# Altium schematic sheet MCU.SchDoc
size A4; Date: 2020/6/21
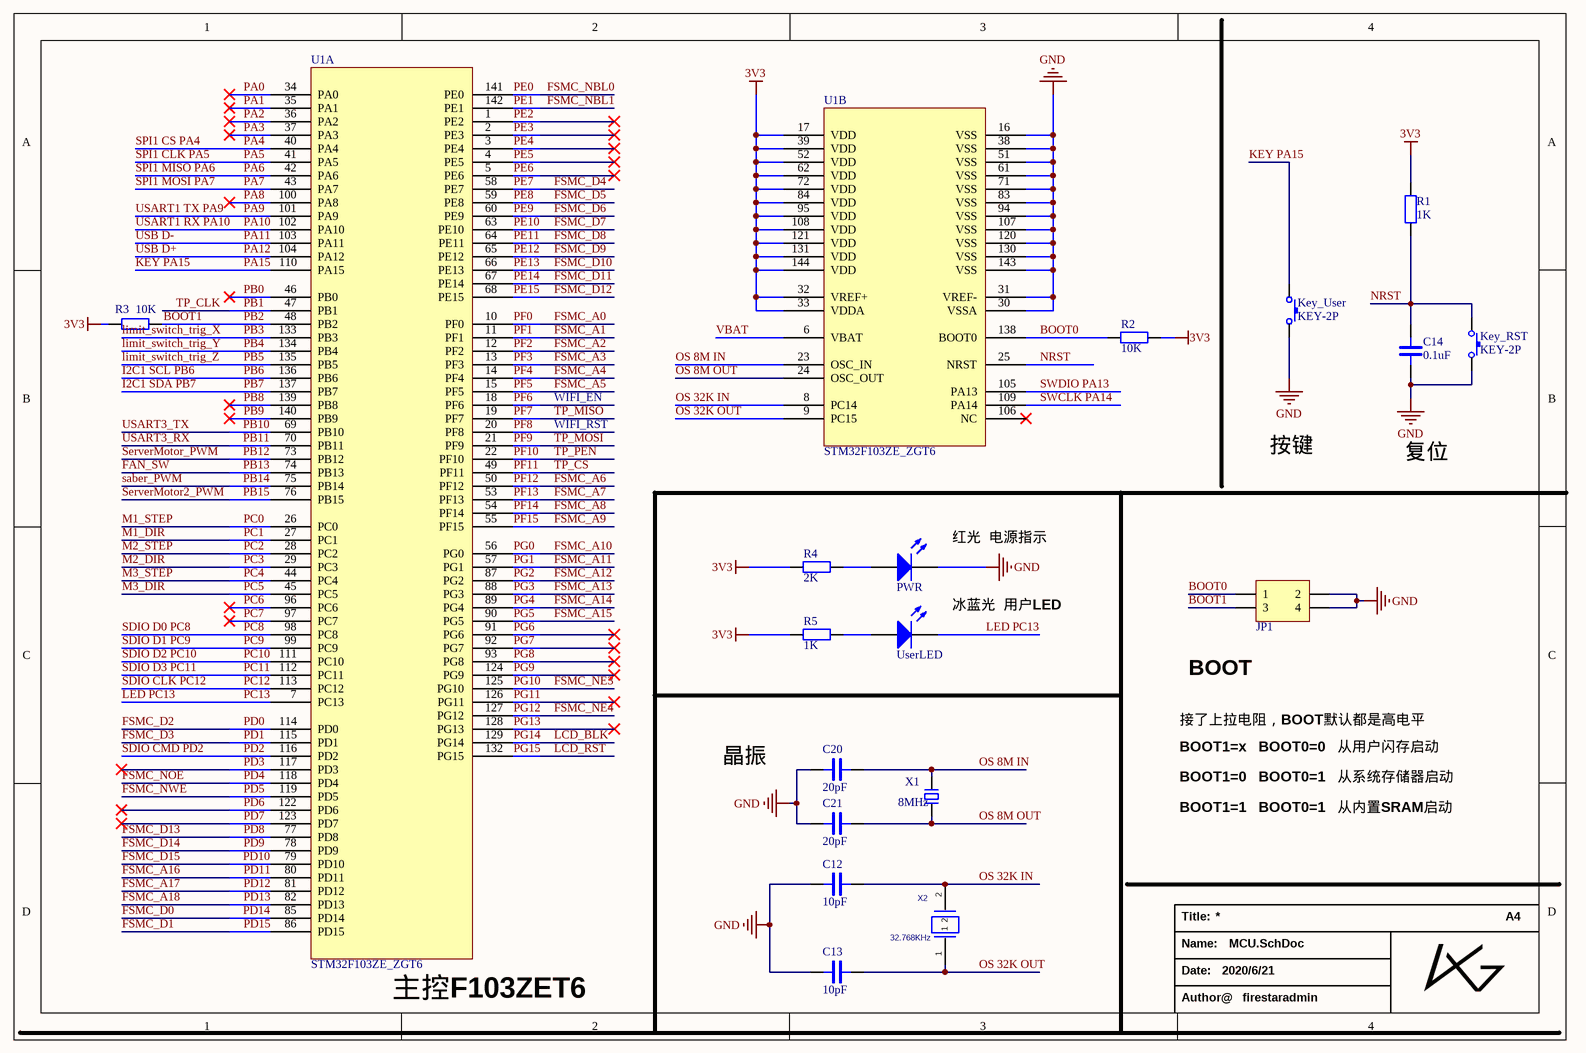
[diagram p0: MCU.SchDoc]

## Parts
C12  10pF  [C 0603_M]
C13  10pF  [C 0603_M]
C14  0.1uF  [C 0603_M]
C20  20pF  [C 0603_M]
C21  20pF  [C 0603_M]
JP1  Header2X2  [HDR2.54-LI-2x2P]  (value not drawn)
Key_RST  KEY-2P  [TSW SMD-3*6*2.5]
Key_User  KEY-2P  [TSW SMD-3*6*2.5]
PWR  LED  [LED 0603R]  (value not drawn)
R1  1K  [R 0603_M]
R2  10K  [R 0603_M]
R3  10K  [R 0603_M]
R4  2K  [R 0603_M]
R5  1K  [R 0603_M]
U1  STM32F103ZE_ZGT6  [TQFP144 20x20_M]  (parts A,B of 2)
UserLED  LED  [LED 0603B]  (value not drawn)
X1  8MHz  [OSC 5032-2P]
X2  value 32.768KHz  [OSC 3215-2P]  (hidden comment: XTAL_32.768KHZ_3215)

## Nets
3V3: R1.1 R2.2 R3.2 R4.2 R5.2 U1.17(VDD) U1.32(VREF+) U1.33(VDDA) U1.39(VDD) U1.52(VDD) U1.62(VDD) U1.72(VDD) U1.84(VDD) U1.95(VDD) U1.108(VDD) U1.121(VDD) U1.131(VDD) U1.144(VDD)
GND: C12.2 C13.2 C14.1 C20.2 C21.2 JP1.2 JP1.4 Key_RST.2 Key_User.2 PWR.2(K) U1.16(VSS) U1.30(VSSA) U1.31(VREF-) U1.38(VSS) U1.51(VSS) U1.61(VSS) U1.71(VSS) U1.83(VSS) U1.94(VSS) U1.107(VSS) U1.120(VSS) U1.130(VSS) U1.143(VSS)
BOOT0: JP1.1 R2.1 U1.138(BOOT0)
BOOT1: JP1.3 R3.1 U1.48(PB2)  [also labelled PB2]
FAN_SW: U1.74(PB13)  [also labelled PB13]
FSMC_A0: U1.10(PF0)  [also labelled PF0]
FSMC_A1: U1.11(PF1)  [also labelled PF1]
FSMC_A2: U1.12(PF2)  [also labelled PF2]
FSMC_A3: U1.13(PF3)  [also labelled PF3]
FSMC_A4: U1.14(PF4)  [also labelled PF4]
FSMC_A5: U1.15(PF5)  [also labelled PF5]
FSMC_A6: U1.50(PF12)  [also labelled PF12]
FSMC_A7: U1.53(PF13)  [also labelled PF13]
FSMC_A8: U1.54(PF14)  [also labelled PF14]
FSMC_A9: U1.55(PF15)  [also labelled PF15]
FSMC_A10: U1.56(PG0)  [also labelled PG0]
FSMC_A11: U1.57(PG1)  [also labelled PG1]
FSMC_A12: U1.87(PG2)  [also labelled PG2]
FSMC_A13: U1.88(PG3)  [also labelled PG3]
FSMC_A14: U1.89(PG4)  [also labelled PG4]
FSMC_A15: U1.90(PG5)  [also labelled PG5]
FSMC_A16: U1.80(PD11)  [also labelled PD11]
FSMC_A17: U1.81(PD12)  [also labelled PD12]
FSMC_A18: U1.82(PD13)  [also labelled PD13]
FSMC_D0: U1.85(PD14)  [also labelled PD14]
FSMC_D1: U1.86(PD15)  [also labelled PD15]
FSMC_D2: U1.114(PD0)  [also labelled PD0]
FSMC_D3: U1.115(PD1)  [also labelled PD1]
FSMC_D4: U1.58(PE7)  [also labelled PE7]
FSMC_D5: U1.59(PE8)  [also labelled PE8]
FSMC_D6: U1.60(PE9)  [also labelled PE9]
FSMC_D7: U1.63(PE10)  [also labelled PE10]
FSMC_D8: U1.64(PE11)  [also labelled PE11]
FSMC_D9: U1.65(PE12)  [also labelled PE12]
FSMC_D10: U1.66(PE13)  [also labelled PE13]
FSMC_D11: U1.67(PE14)  [also labelled PE14]
FSMC_D12: U1.68(PE15)  [also labelled PE15]
FSMC_D13: U1.77(PD8)  [also labelled PD8]
FSMC_D14: U1.78(PD9)  [also labelled PD9]
FSMC_D15: U1.79(PD10)  [also labelled PD10]
FSMC_NBL0: U1.141(PE0)  [also labelled PE0]
FSMC_NBL1: U1.142(PE1)  [also labelled PE1]
FSMC_NE3: U1.125(PG10)  [also labelled PG10]
FSMC_NE4: U1.127(PG12)  [also labelled PG12]
FSMC_NOE: U1.118(PD4)  [also labelled PD4]
FSMC_NWE: U1.119(PD5)  [also labelled PD5]
I2C1 SCL PB6: U1.136(PB6)  [also labelled PB6]
I2C1 SDA PB7: U1.137(PB7)  [also labelled PB7]
KEY PA15: Key_User.1 U1.110(PA15)  [also labelled PA15]
LCD_BLK: U1.129(PG14)  [also labelled PG14]
LCD_RST: U1.132(PG15)  [also labelled PG15]
LED PC13: U1.7(PC13) UserLED.2(K)  [also labelled PC13]
limit_switch_trig_X: U1.133(PB3)  [also labelled PB3]
limit_switch_trig_Y: U1.134(PB4)  [also labelled PB4]
limit_switch_trig_Z: U1.135(PB5)  [also labelled PB5]
M1_DIR: U1.27(PC1)  [also labelled PC1]
M1_STEP: U1.26(PC0)  [also labelled PC0]
M2_DIR: U1.29(PC3)  [also labelled PC3]
M2_STEP: U1.28(PC2)  [also labelled PC2]
M3_DIR: U1.45(PC5)  [also labelled PC5]
M3_STEP: U1.44(PC4)  [also labelled PC4]
NRST: C14.2 Key_RST.1 R1.2 U1.25(NRST)
OS 8M IN: C20.1 U1.23(OSC_IN) X1.1
OS 8M OUT: C21.1 U1.24(OSC_OUT) X1.2
OS 32K IN: C12.1 U1.8(PC14) X2.2
OS 32K OUT: C13.1 U1.9(PC15) X2.1
PA0: U1.34(PA0)
PA1: U1.35(PA1)
PA2: U1.36(PA2)
PA3: U1.37(PA3)
PA4: U1.40(PA4)  [also labelled SPI1 CS PA4]
PA5: U1.41(PA5)  [also labelled SPI1 CLK PA5]
PA6: U1.42(PA6)  [also labelled SPI1 MISO PA6]
PA7: U1.43(PA7)  [also labelled SPI1 MOSI PA7]
PA8: U1.100(PA8)
PA9: U1.101(PA9)  [also labelled USART1 TX PA9]
PA10: U1.102(PA10)  [also labelled USART1 RX PA10]
PA11: U1.103(PA11)  [also labelled USB D-]
PA12: U1.104(PA12)  [also labelled USB D+]
PB0: U1.46(PB0)
PB1: U1.47(PB1)  [also labelled TP_CLK]
PB8: U1.139(PB8)
PB9: U1.140(PB9)
PB10: U1.69(PB10)  [also labelled USART3_TX]
PB11: U1.70(PB11)  [also labelled USART3_RX]
PB12: U1.73(PB12)  [also labelled ServerMotor_PWM]
PB14: U1.75(PB14)  [also labelled saber_PWM]
PB15: U1.76(PB15)  [also labelled ServerMotor2_PWM]
PC6: U1.96(PC6)
PC7: U1.97(PC7)
PC8: U1.98(PC8)  [also labelled SDIO D0 PC8]
PC9: U1.99(PC9)  [also labelled SDIO D1 PC9]
PC10: U1.111(PC10)  [also labelled SDIO D2 PC10]
PC11: U1.112(PC11)  [also labelled SDIO D3 PC11]
PC12: U1.113(PC12)  [also labelled SDIO CLK PC12]
PD2: U1.116(PD2)  [also labelled SDIO CMD PD2]
PD3: U1.117(PD3)
PD6: U1.122(PD6)
PD7: U1.123(PD7)
PE2: U1.1(PE2)
PE3: U1.2(PE3)
PE4: U1.3(PE4)
PE5: U1.4(PE5)
PE6: U1.5(PE6)
PF6: U1.18(PF6)
PF7: U1.19(PF7)  [also labelled TP_MISO]
PF8: U1.20(PF8)
PF9: U1.21(PF9)  [also labelled TP_MOSI]
PF10: U1.22(PF10)  [also labelled TP_PEN]
PF11: U1.49(PF11)  [also labelled TP_CS]
PG6: U1.91(PG6)
PG7: U1.92(PG7)
PG8: U1.93(PG8)
PG9: U1.124(PG9)
PG11: U1.126(PG11)
PG13: U1.128(PG13)
SWCLK PA14: U1.109(PA14)
SWDIO PA13: U1.105(PA13)
VBAT: U1.6(VBAT)
NetPWR_1: PWR.1(A) R4.1
NetR5_1: R5.1 UserLED.1(A)

Not connected (* = marked no-connect by the designer): U1 106(NC)*

## Notes on the sheet
- WIFI_RST
- WIFI_EN
- 按键
- 复位
- (near PWR) 红光  电源指示
- 冰蓝光  用户LED
- 接了上拉电阻，BOOT默认都是高电平
- BOOT
- 晶振
- BOOT1=x   BOOT0=0   从用户闪存启动
- BOOT1=0   BOOT0=1   从系统存储器启动
- BOOT1=1   BOOT0=1   从内置SRAM启动
- (near U1) 主控F103ZET6
- Title:
- A4
- Name:
- Date:
- Author@
- firestaradmin

## Library data of the parts
C12-C14 C20 C21 = CAP: Capacitor
JP1 = Header 2X2: 2*2P接插件; 版权归属: 源创客; BOM名称: 2*2P接插件; 学习资源: www.ooocke.com
Key_RST Key_User = KEY-2P: Key
R1-R5 = RES: Resistor
X1 = XTAL-2P: 2脚无源脚晶振; 版权归属: 源创客; BOM名称: 2脚无源脚晶振; 学习资源: www.ooocke.com
X2 = XTAL_32.768KHZ_3215: CRYSTAL; PCB DECAL: 3215